# EAGLE design RS232_Prog+Conn_Adapter (EAGLE 7.6.0)
RS232 Adapter for Programmer and Communication
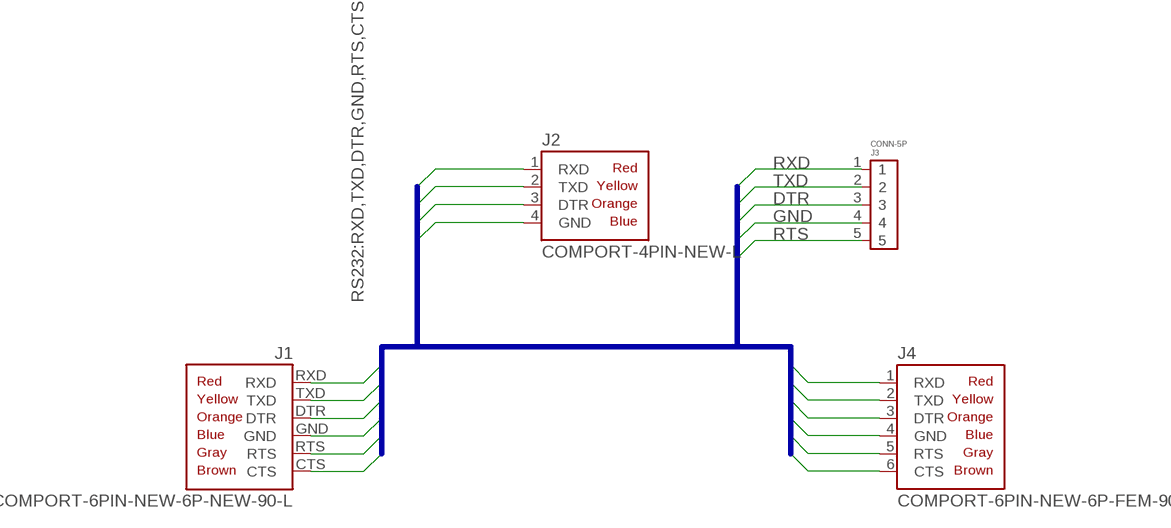
[diagram p0: schematic, sheet 1]

## Parts
J1  COMPORT-6PIN-NEW-6P-NEW-90-L  [RS232-6PIN-NEW-90-L]
J2  COMPORT-4PIN-NEW-L  [RS232-4PIN-NEW-L]
J3  CONN-5P  [CONN-5P-N]
J4  COMPORT-6PIN-NEW-6P-FEM-90  [CONN-6P-FEM-90]

## Nets
CTS: J1.CTS J4.6(CTS)
DTR: J1.DTR J2.3(DTR) J3.3 J4.3(DTR)
GND: J1.GND J2.4(GND) J3.4 J4.4(GND)
RTS: J1.RTS J3.5 J4.5(RTS)
RXD: J1.RXD J2.1(RXD) J3.1 J4.1(RXD)
TXD: J1.TXD J2.2(TXD) J3.2 J4.2(TXD)

## Buses
RS232:RXD,TXD,DTR,GND,RTS,CTS

## Library data of the parts
J1 J4 = pinconn:COMPORT-6PIN-NEW
J2 = pinconn:COMPORT-4PIN-NEW
J3 = pinconn:CONN-5P

## Net classes
0 default: width 0.61 mm

## Board
RS232 Adapter for Programmer and Communication
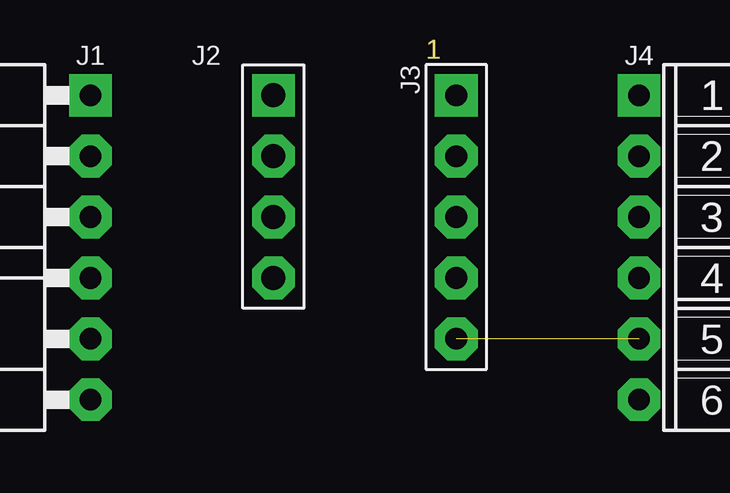
[diagram p1: board, top side]
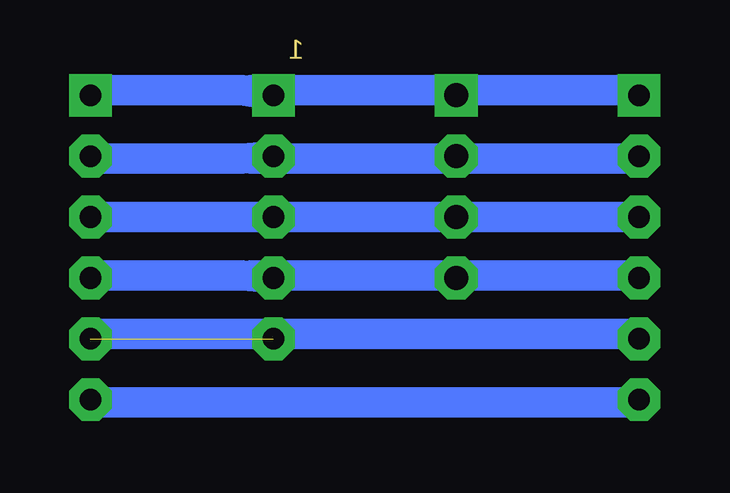
[diagram p2: board, bottom side, seen from below]

No outline drawn. Coordinates in mm, seen from the top.
Copper layers (1*16): Top 0.035mm / dielectric 1.5mm / Bottom 0.035mm
Design rules "default": minimum track width 10mil, minimum drill 24mil, track to track 8mil, track to pad 8mil, pad to pad 8mil, via to via 8mil, smd to smd 8mil, copper to edge 40mil, drill to drill 8mil, minimum pad ring 10mil, minimum via ring 8mil, stop-mask expansion 4mil, vias tented up to drill 0mil, thermal gap 10mil

### Footprints (pad centres in the part's own frame; a part is rotated, then mirrored left to right if it is on the bottom)
RS232-6PIN-NEW-90-L = drill 0.9 pad 1.778 octagon: CTS 0,-6.35; DTR 0,1.27; GND 0,-1.27; RTS 0,-3.81; TXD 0,3.81 | drill 0.9 pad 1.778 square: RXD 0,6.35
RS232-4PIN-NEW-L = drill 1 pad 1.778 square: 1 0,-3.81 | drill 1 pad 1.778 octagon: 2 0,-1.27; 3 0,1.27; 4 0,3.81
CONN-5P-N = drill 0.9 pad 1.778 square: 1 -5.08,0 | drill 0.9 pad 1.778 octagon: 2 -2.54,0; 3 0,0; 4 2.54,0; 5 5.08,0
CONN-6P-FEM-90 = drill 0.9 pad 1.778 square: 1 -6.35,0 | drill 0.9 pad 1.778 octagon: 2 -3.81,0; 3 -1.27,0; 4 1.27,0; 5 3.81,0; 6 6.35,0

### Placement (x,y rotation side)
J1  2.54,8.89 0 top
J2  10.16,11.43 180 top
J3  17.78,10.16 270 top
J4  25.4,8.89 270 top

### Tracks (layer width: path | path; a pad name or v marks a point on that pad's centre or on a via)
CTS
  Bottom 1.27: J4.6 25.4,2.44 2.85,2.44 J1.CTS
DTR
  Bottom 1.27: J1.DTR J2.3 J3.3 J4.3
GND
  Bottom 1.27: 10.16,7.72 2.85,7.72 J1.GND | J4.4 25.4,7.72 19.1,7.72 J3.4 18.69,7.72 10.16,7.72 | 10.16,7.72 J2.4
RTS  (1 unrouted)
  Bottom 1.27: J4.5 25.4,5.28 2.85,5.28 J1.RTS
RXD
  Bottom 1.27: 10.16,15.44 2.85,15.44 J1.RXD | J4.1 25.4,15.44 19.1,15.44 J3.1 18.69,15.44 10.16,15.44 | 10.16,15.44 J2.1
TXD
  Bottom 1.27: 10.16,12.6 2.85,12.6 J1.TXD | J4.2 25.4,12.6 19.1,12.6 J3.2 18.69,12.6 10.16,12.6 | 10.16,12.6 J2.2